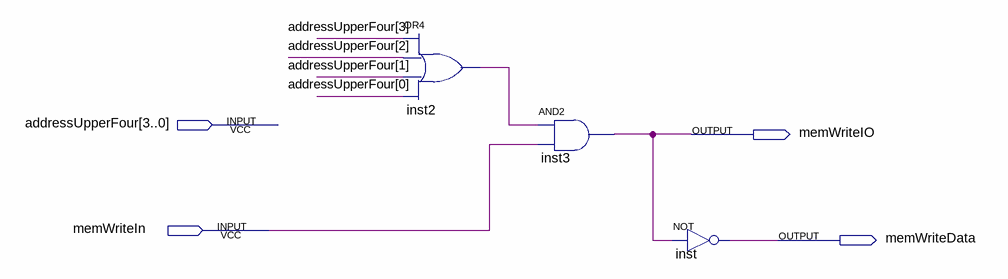
[diagram p0: schematic sheet]
// Quartus schematic IsItIO.bdf as structural Verilog: 3 symbols, 4 pins
module IsItIO (
  input  [3:0] addressUpperFour,
  input  memWriteIn,
  output memWriteIO,
  output memWriteData
);

  wire inst2_out;

  or inst2 (inst2_out, addressUpperFour[3], addressUpperFour[2], addressUpperFour[1], addressUpperFour[0]);
  and inst3 (memWriteIO, inst2_out, memWriteIn);
  not inst (memWriteData, memWriteIO);
endmodule
